# Altium schematic sheet Right Channel Audio.SchDoc: Right Channel Audio
size A4; Organization: Altium Limited; Address1: L3, 12a Rodborough Rd; Address2: Frenchs Forest; Address3: NSW; Address4: Australia 2086; Revision: 1; SheetNumber: 11; SheetTotal: 11; Alumno: Diego Caceres; Curso: R1051; Materia: Sistemas de Representación; Docentes: Ing. Perdomo, Ing. Fuoco, Ing. Giorno, Sr. Vergili
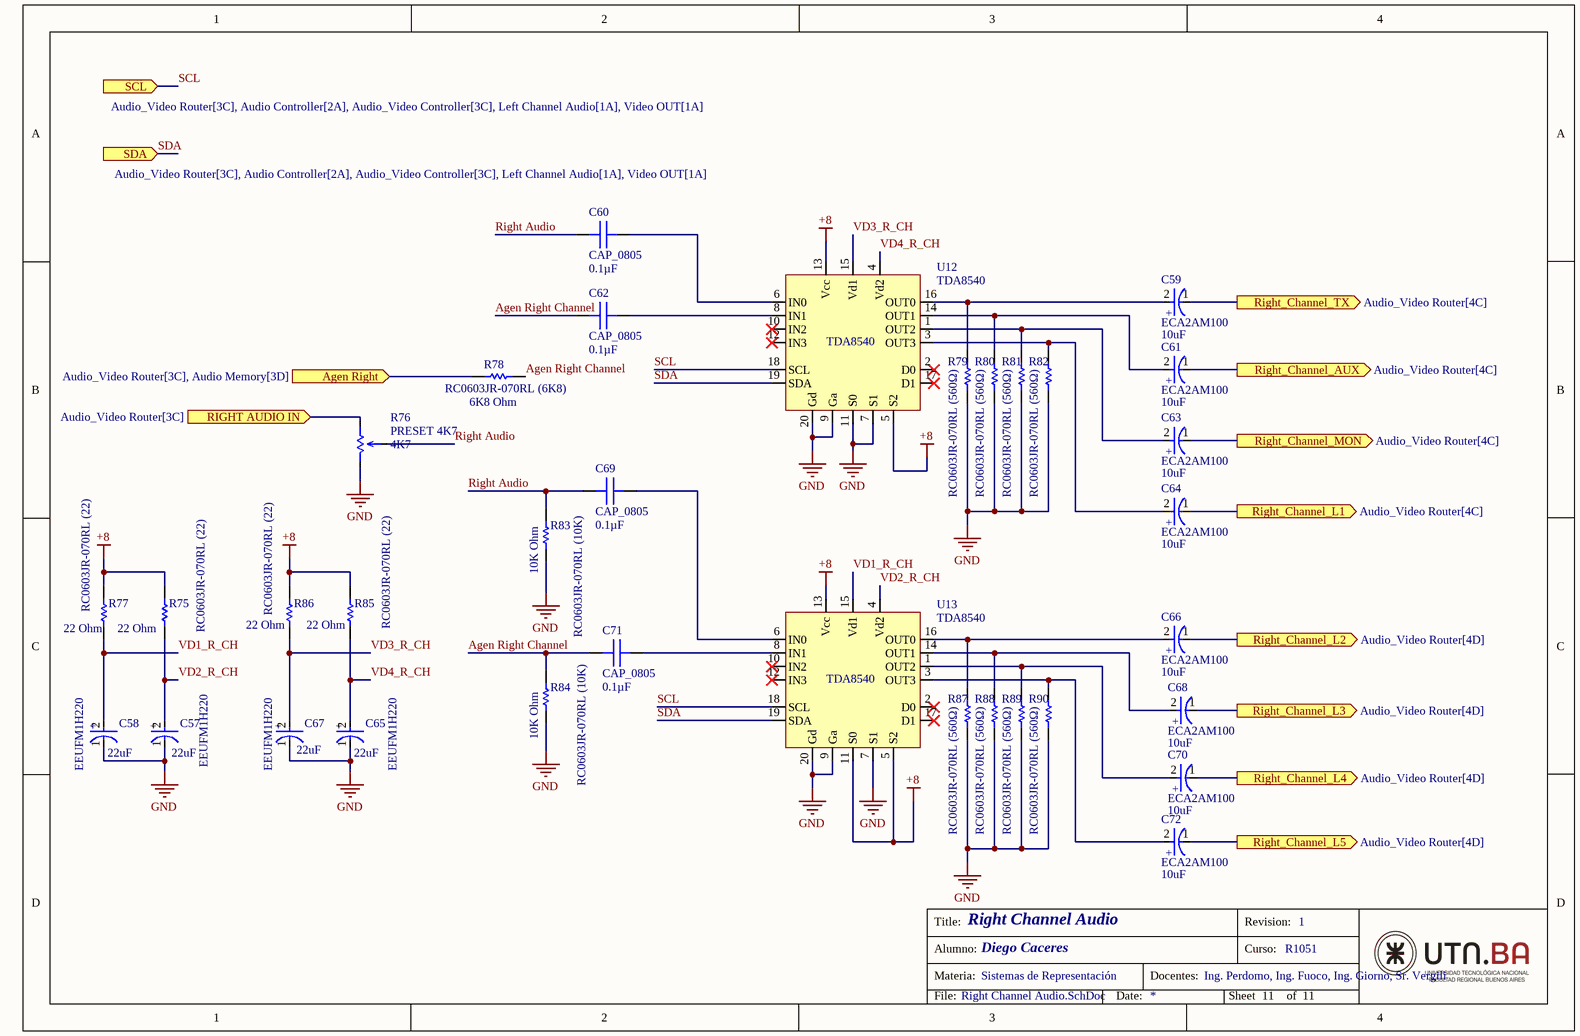
[diagram p0: Right Channel Audio.SchDoc]

## Parts
C57  EEUFM1H220  Capacitance: 22uF  [FP-RAD-TH-D_5_0_5-L_11_1-MFG]
C58  EEUFM1H220  Capacitance: 22uF  [FP-RAD-TH-D_5_0_5-L_11_1-MFG]
C59  ECA2AM100  Capacitance: 10uF  [FP-RAD-TH-D_5_0_5-L_11_1-MFG]
C60  CAP_0805  value 0.1µF  [0805_CAPACITOR_DCACERES]
C61  ECA2AM100  Capacitance: 10uF  [FP-RAD-TH-D_5_0_5-L_11_1-MFG]
C62  CAP_0805  value 0.1µF  [0805_CAPACITOR_DCACERES]
C63  ECA2AM100  Capacitance: 10uF  [FP-RAD-TH-D_5_0_5-L_11_1-MFG]
C64  ECA2AM100  Capacitance: 10uF  [FP-RAD-TH-D_5_0_5-L_11_1-MFG]
C65  EEUFM1H220  Capacitance: 22uF  [FP-RAD-TH-D_5_0_5-L_11_1-MFG]
C66  ECA2AM100  Capacitance: 10uF  [FP-RAD-TH-D_5_0_5-L_11_1-MFG]
C67  EEUFM1H220  Capacitance: 22uF  [FP-RAD-TH-D_5_0_5-L_11_1-MFG]
C68  ECA2AM100  Capacitance: 10uF  [FP-RAD-TH-D_5_0_5-L_11_1-MFG]
C69  CAP_0805  value 0.1µF  [0805_CAPACITOR_DCACERES]
C70  ECA2AM100  Capacitance: 10uF  [FP-RAD-TH-D_5_0_5-L_11_1-MFG]
C71  CAP_0805  value 0.1µF  [0805_CAPACITOR_DCACERES]
C72  ECA2AM100  Capacitance: 10uF  [FP-RAD-TH-D_5_0_5-L_11_1-MFG]
R75  RC0603JR-070RL (22)  Resistance: 22 Ohm  [RESC1608X55X25ML10T15]
R76  PRESET 4K7  value 4K7  [3386P_PRESET_4K7_DCaceres]
R77  RC0603JR-070RL (22)  Resistance: 22 Ohm  [RESC1608X55X25ML10T15]
R78  RC0603JR-070RL (6K8)  Resistance: 6K8 Ohm  [RESC1608X55X25ML10T15]
R79  RC0603JR-070RL (560Ω)  [RESC1608X55X25ML10T15]
R80  RC0603JR-070RL (560Ω)  [RESC1608X55X25ML10T15]
R81  RC0603JR-070RL (560Ω)  [RESC1608X55X25ML10T15]
R82  RC0603JR-070RL (560Ω)  [RESC1608X55X25ML10T15]
R83  RC0603JR-070RL (10K)  Resistance: 10K Ohm  [RESC1608X55X25ML10T15]
R84  RC0603JR-070RL (10K)  Resistance: 10K Ohm  [RESC1608X55X25ML10T15]
R85  RC0603JR-070RL (22)  Resistance: 22 Ohm  [RESC1608X55X25ML10T15]
R86  RC0603JR-070RL (22)  Resistance: 22 Ohm  [RESC1608X55X25ML10T15]
R87  RC0603JR-070RL (560Ω)  [RESC1608X55X25ML10T15]
R88  RC0603JR-070RL (560Ω)  [RESC1608X55X25ML10T15]
R89  RC0603JR-070RL (560Ω)  [RESC1608X55X25ML10T15]
R90  RC0603JR-070RL (560Ω)  [RESC1608X55X25ML10T15]
U12  TDA8540  [SOT146-1_DIP20_TDA8540_DCACERES]
U13  TDA8540  [SOT146-1_DIP20_TDA8540_DCACERES]

## Ports
Agen Right (in, see Audio_Video Router[3C], Audio Memory[3D]), RIGHT AUDIO IN (in, see Audio_Video Router[3C]), Right_Channel_AUX (out, see Audio_Video Router[4C]), Right_Channel_L1 (out, see Audio_Video Router[4C]), Right_Channel_L2 (out, see Audio_Video Router[4D]), Right_Channel_L3 (out, see Audio_Video Router[4D]), Right_Channel_L4 (out, see Audio_Video Router[4D]), Right_Channel_L5 (out, see Audio_Video Router[4D]), Right_Channel_MON (out, see Audio_Video Router[4C]), Right_Channel_TX (out, see Audio_Video Router[4C]), SCL (in, see Audio_Video Router[3C], Audio Controller[2A], Audio_Video Controller[3C], Left Channel Audio[1A], Video OUT[1A]), SDA (in, see Audio_Video Router[3C], Audio Controller[2A], Audio_Video Controller[3C], Left Channel Audio[1A], Video OUT[1A])

## Nets
+8: R75.2 R77.2 R85.2 R86.2 U12.5(S2) U12.13(Vcc) U13.5(S2) U13.11(S0) U13.13(Vcc)
GND: C57.1(C) C58.1(C) C65.1(C) C67.1(C) R76.1 R79.2 R80.2 R81.2 R82.2 R83.1 R84.1 R87.2 R88.2 R89.2 R90.2 U12.7(S1) U12.9(Ga) U12.11(S0) U12.20(Gd) U13.7(S1) U13.9(Ga) U13.20(Gd)
Agen Right: R78.1 ; port Agen Right
Agen Right Channel: C62.1 C71.1 R78.2 R84.2
Right Audio: C60.1 C69.1 R76.3 R83.2
RIGHT AUDIO IN: R76.2 ; port RIGHT AUDIO IN
Right_Channel_AUX: C61.1(C) ; port Right_Channel_AUX
Right_Channel_L1: C64.1(C) ; port Right_Channel_L1
Right_Channel_L2: C66.1(C) ; port Right_Channel_L2
Right_Channel_L3: C68.1(C) ; port Right_Channel_L3
Right_Channel_L4: C70.1(C) ; port Right_Channel_L4
Right_Channel_L5: C72.1(C) ; port Right_Channel_L5
Right_Channel_MON: C63.1(C) ; port Right_Channel_MON
Right_Channel_TX: C59.1(C) ; port Right_Channel_TX
SCL: U12.18(SCL) U13.18(SCL) ; port SCL
SDA: U12.19(SDA) U13.19(SDA) ; port SDA
VD1_R_CH: C58.2(A) R77.1 U13.15(Vd1)
VD2_R_CH: C57.2(A) R75.1 U13.4(Vd2)
VD3_R_CH: C67.2(A) R86.1 U12.15(Vd1)
VD4_R_CH: C65.2(A) R85.1 U12.4(Vd2)
NetC59_2: C59.2(A) R79.1 U12.16(OUT0)
NetC60_2: C60.2 U12.6(IN0)
NetC61_2: C61.2(A) R80.1 U12.14(OUT1)
NetC62_2: C62.2 U12.8(IN1)
NetC63_2: C63.2(A) R81.1 U12.1(OUT2)
NetC64_2: C64.2(A) R82.1 U12.3(OUT3)
NetC66_2: C66.2(A) R87.1 U13.16(OUT0)
NetC68_2: C68.2(A) R88.1 U13.14(OUT1)
NetC69_2: C69.2 U13.6(IN0)
NetC70_2: C70.2(A) R89.1 U13.1(OUT2)
NetC71_2: C71.2 U13.8(IN1)
NetC72_2: C72.2(A) R90.1 U13.3(OUT3)

Not connected (* = marked no-connect by the designer): U12 2(D0)* 10(IN2)* 12(IN3)* 17(D1)*; U13 2(D0)* 10(IN2)* 12(IN3)* 17(D1)*

## Notes on the sheet
- Title:
- Revision:
- Alumno:
- Materia:
- Docentes:
- Curso:
- File:
- Date:
- Sheet
- of
- (in symbol CMP-05427-000661-1) +
- (in symbol CMP-05427-000869-1) +

## Library data of the parts
C57 C58 C65 C67 = CMP-05427-000661-1: Aluminum Electrolytic Capacitors (Radial Lead Type) 22uF ±20% 50V; Impedance: 340mR; Life (Hours): 2000Hour; Dissipation Factor: 0.1%; Ripple Current: 250mA; Lead Diameter: 0.5mm; REACH SVHC: No SVHC; Tolerance: 20%; Max Operating Temperature: 105°C; RoHS Compliant: Yes; Height - Seated (Max): 0.492inch; Number of Pins: 2; Case/Package: Radial; Series: FM; ESR (Equivalent Series Resistance): 340mR; Length: 11mm; Radiation Hardening: No; Voltage: 50V; Min Operating Temperature: -40°C; Voltage Rating: 50V; Voltage Rating (DC): 50V; Lead Free: Lead Free; Package Quantity: 200; Lead Pitch: 2mm; Height: 11mm; Mount: Through Hole; Construction: RADIAL; Termination: Radial; Diameter: 5mm; Packaging: Bulk
C59 C61 C63 C64 C66 C68 C70 C72 = CMP-05427-000869-1: Aluminum Electrolytic Capacitors (Radial Lead Type) 10uF ±20% 100V; Polarity: Polar; Lead Diameter: 0.5mm; Dissipation Factor: 0.1%; Leakage Current: 3uA; Dielectric Material: Aluminium; Ripple Current: 70mA; Life (Hours): 2000Hour; Lead/Base Style: Straight; Length: 11mm; Case/Package: Radial; Lead Pitch: 2mm; Contact Plating: Tin; RoHS Compliant: Yes; Radiation Hardening: No; Max Operating Temperature: 85°C; Lead Free: Lead Free; Termination: Radial; Voltage Rating: 100V; Package Quantity: 200; Voltage: 100V; Construction: RADIAL; Height: 11mm; Min Operating Temperature: -40°C; Diameter: 5mm; REACH SVHC: No SVHC; Tolerance: 20%; Width: 5mm; Height - Seated (Max): 0.472inch; Mount: Through Hole; Series: M; Voltage Rating (DC): 100V; Packaging: Bulk; Ripple Current (AC): 70mA; Number of Pins: 2
C60 C62 C69 C71 = CAPACITOR_0805_Caceres: Capacitor SMD, encapsulado 0805; SizePackage: 0805; ComponentLink1Description: Datasheet1; ComponentLink1URL: https://www.mouser.com/datasheet/2/40/AutoMLCCKAM-3216307.pdf; ComponentLink2Description: Datasheet2; ComponentLink2URL: https://www.mouser.com/datasheet/2/447/KEM_C1086_U2J-3316409.pdf; ComponentLink3Description: Datasheet3; ComponentLink3URL: https://product.tdk.com/system/files/dam/doc/product/capacitor/ceramic/mlcc/catalog/mlcc_commercial_soft_en.pdf
R75 R77 R78 R83-R86 = CMP-2100-03667-1: Chip Resistor, 0 Ohm, +/- 5%, 0.1 W, -55 to 155 degC, 0603 (1608 Metric), RoHS, Tape and Reel; Manufacturer: Yageo; Temperature Coefficient: 200ppm/degreesC; Voltage Rating: 50V; Power Rating: 100mW; Width: 0.8mm; Max Operating Temperature: 155degC; Tolerance: 5%; Package Reference: 0603; Height: 0.45mm; Depth: 0.8mm; Package Description: 2-Pin Surface Mount Device, Body 1.6 x 0.8 mm; Termination: SMD/SMT; Package Quantity: 5000; Case/Package: 0603; Case Code (Imperial): 0603; Radiation Hardening: No; Number of Pins: 2; Length: 1.6mm; Lead Free: LeadFree; Voltage Rating (DC): 50V; Military Standard: Not; Datasheet URL: http://www.yageo.com/NewPortal/yageodocoutput?fileName=/pdf/R-Chip/PYu-RC_Group_51_RoHS_L_5.pdf; Manufacturer URL: http://www.yageo.com/; Packaging: TapeandReel; Case Code (Metric): 1608; Min Operating Temperature: -55degC; Composition: ThickFilm; RoHSCompliant: true; Contact Plating: Tin; Datasheet Version: Rev. 5, 10/2016; REACH SVHC: NoSVHC
R76 = Preset_4K7_Caceres: Preset 4K7, Thru HoleManufacturer Part Search 3386P-1-472LF; PartNumber: 3386P-1-472LF; ComponentLink1Description: Package Specification; ComponentLink1URL: https://ar.mouser.com/datasheet/2/54/3386-776606.pdf; ComponentLink2Description: URL Link; ComponentLink2URL: https://www.mouser.com/ProductDetail/Bourns/3386P-1-472LF?qs=g1MxsQ5vwlSvqan31esVSg%3D%3D
R79-R82 R87-R90 = CMP-2100-03667-1: Chip Resistor, 0 Ohm, +/- 5%, 0.1 W, -55 to 155 degC, 0603 (1608 Metric), RoHS, Tape and Reel; Manufacturer: Yageo; Temperature Coefficient: 200ppm/degreesC; Voltage Rating: 50V; Power Rating: 100mW; Resistance: 560 Ohm; Width: 0.8mm; Max Operating Temperature: 155degC; Tolerance: 5%; Package Reference: 0603; Height: 0.45mm; Depth: 0.8mm; Package Description: 2-Pin Surface Mount Device, Body 1.6 x 0.8 mm; Termination: SMD/SMT; Package Quantity: 5000; Case/Package: 0603; Case Code (Imperial): 0603; Radiation Hardening: No; Number of Pins: 2; Length: 1.6mm; Lead Free: LeadFree; Voltage Rating (DC): 50V; Military Standard: Not; Datasheet URL: http://www.yageo.com/NewPortal/yageodocoutput?fileName=/pdf/R-Chip/PYu-RC_Group_51_RoHS_L_5.pdf; Manufacturer URL: http://www.yageo.com/; Packaging: TapeandReel; Case Code (Metric): 1608; Min Operating Temperature: -55degC; Composition: ThickFilm; RoHSCompliant: true; Contact Plating: Tin; Datasheet Version: Rev. 5, 10/2016; REACH SVHC: NoSVHC
U12 U13 = TDA8540_Caceres: TDA8540, Thtu Hole / Plastic dual in-line package; 20 leads (300 mil); DIP20; SOT146-1.; ComponentLink1Description: Datasheet; ComponentLink1URL: https://pdf1.alldatasheet.es/datasheet-pdf/view/19499/PHILIPS/TDA8540.html; ComponentLink2Description: URL Link; ComponentLink2URL: https://www.nxp.com/products/no-longer-manufactured/tda8540t:TDA8540T; ComponentLink3Description: Discontinuation Notice; ComponentLink3URL: https://www.nxp.com/wcm_documents/products/eol/dn46exha.pdf; ComponentLink4Description: Package Specification; ComponentLink4URL: https://html.alldatasheet.es/html-pdf/19499/PHILIPS/TDA8540/3258/13/TDA8540.html; PartNumber: TDA8540; PackageReference: DIP20; Status: Discontinued